# EAGLE schematic Toy (EAGLE 9.5.2)
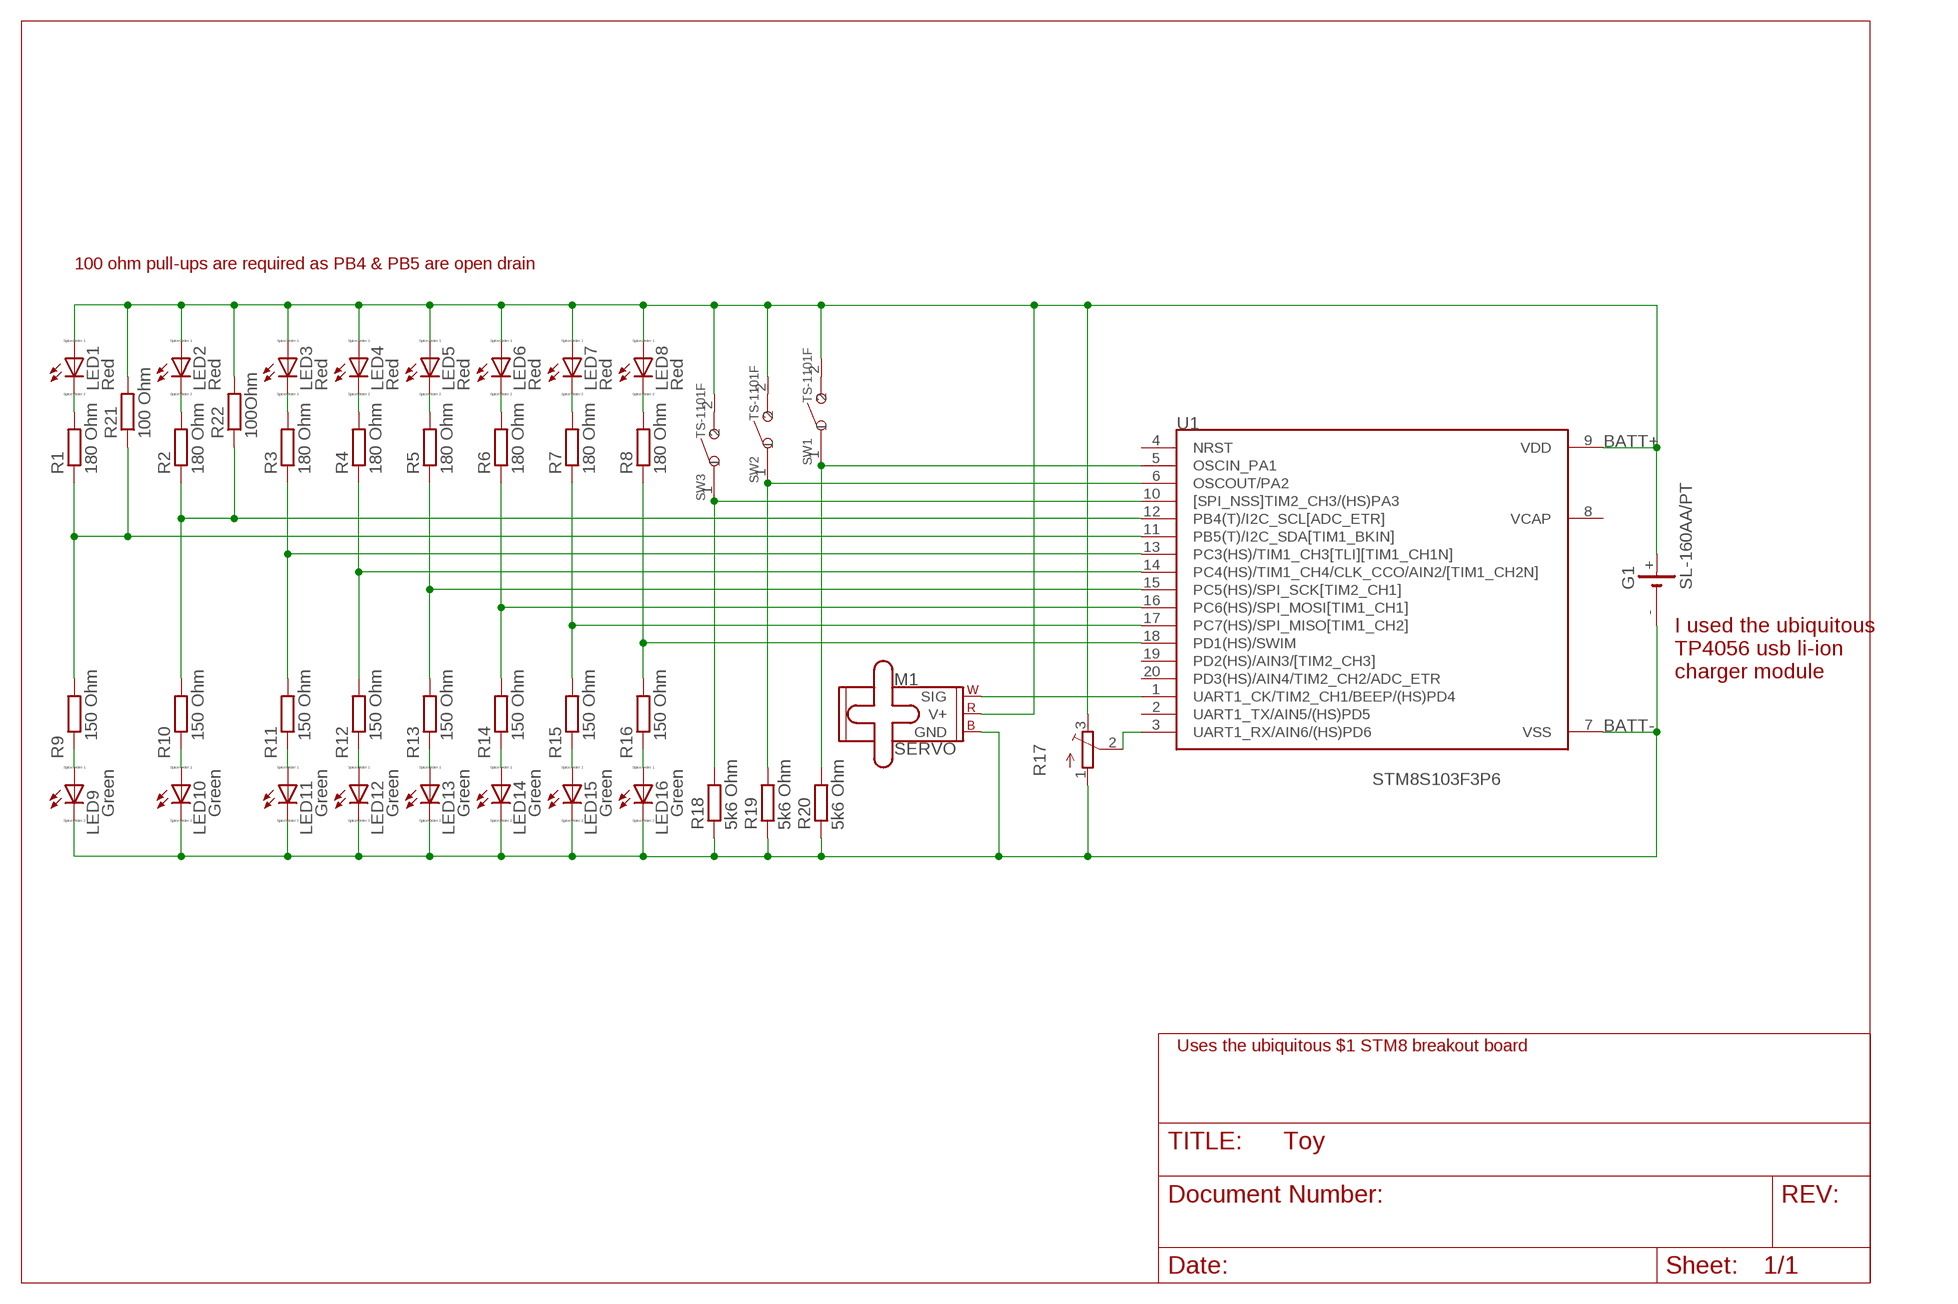
[diagram p0: schematic, sheet 1]

## Parts
G1  SL-160AA/PT  [SL-160AA/PT]
LED1  Red  LED_ELD260  [LED_LD260]
LED2  Red  LED_ELD260  [LED_LD260]
LED3  Red  LED_ELD260  [LED_LD260]
LED4  Red  LED_ELD260  [LED_LD260]
LED5  Red  LED_ELD260  [LED_LD260]
LED6  Red  LED_ELD260  [LED_LD260]
LED7  Red  LED_ELD260  [LED_LD260]
LED8  Red  LED_ELD260  [LED_LD260]
LED9  Green  LED_ELD260  [LED_LD260]
LED10  Green  LED_ELD260  [LED_LD260]
LED11  Green  LED_ELD260  [LED_LD260]
LED12  Green  LED_ELD260  [LED_LD260]
LED13  Green  LED_ELD260  [LED_LD260]
LED14  Green  LED_ELD260  [LED_LD260]
LED15  Green  LED_ELD260  [LED_LD260]
LED16  Green  LED_ELD260  [LED_LD260]
M1  SERVO  [1X03]
R1  180 Ohm  R-EU_0204/7  [0204/7]
R2  180 Ohm  R-EU_0204/7  [0204/7]
R3  180 Ohm  R-EU_0204/7  [0204/7]
R4  180 Ohm  R-EU_0204/7  [0204/7]
R5  180 Ohm  R-EU_0204/7  [0204/7]
R6  180 Ohm  R-EU_0204/7  [0204/7]
R7  180 Ohm  R-EU_0204/7  [0204/7]
R8  180 Ohm  R-EU_0204/7  [0204/7]
R9  150 Ohm  R-EU_0204/7  [0204/7]
R10  150 Ohm  R-EU_0204/7  [0204/7]
R11  150 Ohm  R-EU_0204/7  [0204/7]
R12  150 Ohm  R-EU_0204/7  [0204/7]
R13  150 Ohm  R-EU_0204/7  [0204/7]
R14  150 Ohm  R-EU_0204/7  [0204/7]
R15  150 Ohm  R-EU_0204/7  [0204/7]
R16  150 Ohm  R-EU_0204/7  [0204/7]
R17  TRIM_EU-3223G  [3223G]
R18  5k6 Ohm  R-EU_0204/7  [0204/7]
R19  5k6 Ohm  R-EU_0204/7  [0204/7]
R20  5k6 Ohm  R-EU_0204/7  [0204/7]
R21  100 Ohm  R-EU_0204/7  [0204/7]
R22  100Ohm  R-EU_0204/7  [0204/7]
SW1  TS-1101F  DIP-BUTTON(2P-6.0X3.0X4.3MM)-TS-1101F  [SW2-5.0-6.0X3.0X4.3MM]
SW2  TS-1101F  DIP-BUTTON(2P-6.0X3.0X4.3MM)-TS-1101F  [SW2-5.0-6.0X3.0X4.3MM]
SW3  TS-1101F  DIP-BUTTON(2P-6.0X3.0X4.3MM)-TS-1101F  [SW2-5.0-6.0X3.0X4.3MM]
U1  STM8S103F3P6  [SOP65P640X120-20N]

## Nets
BATT+: G1.+ LED1.A LED2.A LED3.A LED4.A LED5.A LED6.A LED7.A LED8.A M1.2(V+) R17.3(E) R21.2 R22.2 SW1.2 SW2.2 SW3.2 U1.9(VDD)
BATT-: G1.- LED9.K(C) LED10.K(C) LED11.K(C) LED12.K(C) LED13.K(C) LED14.K(C) LED15.K(C) LED16.K(C) M1.3(GND) R17.1(A) R18.1 R19.1 R20.1 U1.7(VSS)
N$1: LED9.A R9.1
N$2: LED10.A R10.1
N$3: LED11.A R11.1
N$4: LED12.A R12.1
N$5: LED13.A R13.1
N$6: LED14.A R14.1
N$7: LED15.A R15.1
N$8: LED16.A R16.1
N$9: LED1.K(C) R1.2
N$10: LED2.K(C) R2.2
N$11: LED3.K(C) R3.2
N$12: LED4.K(C) R4.2
N$13: LED5.K(C) R5.2
N$14: LED6.K(C) R6.2
N$15: LED7.K(C) R7.2
N$16: LED8.K(C) R8.2
N$17: R1.1 R9.2 R21.1 U1.11(PB5(T)/I2C_SDA[TIM1_BKIN])
N$18: R2.1 R10.2 R22.1 U1.12(PB4(T)/I2C_SCL[ADC_ETR])
N$19: R3.1 R11.2 U1.13(PC3(HS)/TIM1_CH3[TLI][TIM1_CH1N])
N$20: R5.1 R13.2 U1.15(PC5(HS)/SPI_SCK[TIM2_CH1])
N$21: R4.1 R12.2 U1.14(PC4(HS)/TIM1_CH4/CLK_CCO/AIN2/[TIM1_CH2N])
N$22: R6.1 R14.2 U1.16(PC6(HS)/SPI_MOSI[TIM1_CH1])
N$23: R7.1 R15.2 U1.17(PC7(HS)/SPI_MISO[TIM1_CH2])
N$24: R8.1 R16.2 U1.18(PD1(HS)/SWIM)
N$25: M1.1(SIG) U1.1(UART1_CK/TIM2_CH1/BEEP/(HS)PD4)
N$26: R20.2 SW1.1 U1.5(OSCIN_PA1)
N$27: R19.2 SW2.1 U1.6(OSCOUT/PA2)
N$28: R18.2 SW3.1 U1.10([SPI_NSS]TIM2_CH3/(HS)PA3)
N$29: R17.2(S) U1.3(UART1_RX/AIN6/(HS)PD6)
Unconnected: G1.-@1(-) U1.2(UART1_TX/AIN5/(HS)PD5) U1.4(NRST) U1.8(VCAP) U1.19(PD2(HS)/AIN3/[TIM2_CH3]) U1.20(PD3(HS)/AIN4/TIM2_CH2/ADC_ETR)

## Notes on the sheet
- 100 ohm pull-ups are required as PB4 & PB5 are open drain
- I used the ubiquitous 
  TP4056 usb li-ion 
  charger module
- Uses the ubiquitous $1 STM8 breakout board

## Library data of the parts
G1 = battery:SL-160AA/PT: LI BATTERY Sonnenschein
LED1-LED16 = eagle-ltspice:LED_E: LED Source: http://www.osram.convergy.de Source: www.luxeon.com Source: www.kingbright.com; SPICEMODEL: NONE; SPICEPREFIX: D; SPICETYPE: diode
M1 = SparkFun-Electromechanical:SERVO: Servo Motor 3-pin connector for a standard servo motor (voltage supply, ground, and control signal.) SparkFun Products Servo - Generic (Sub-Micro Size) <https://www.sparkfun.com/products/9065> (ROB-09065) Servo - Generic High Torque Continuous Rotation (Standard Size) <https://www.sparkfun.com/products/9347> (ROB-09347) Servo - Generic High Torque (Standard Size) <https://www.sparkfun.com/products/11965> (ROB-11965)
R1-R16 R18-R20 = rcl:R-EU_: RESISTOR, European symbol; SPICEPREFIX: R
R17 = pot:TRIM_EU-: POTENTIOMETER
R21 R22 = resistor:R-EU_: RESISTOR, European symbol
SW1-SW3 = Seeed-Switch:DIP-BUTTON(2P-6.0X3.0X4.3MM): 311020025; MPN: TS-1101F
U1 = STM8S103F3P6:STM8S103F3P6: Mainstream Access line 8-bit MCU with 8 Kbytes Flash, 16 MHz CPU, integrated EEPROM; AVAILABILITY: Unavailable; DESCRIPTION: STM8 STM8S Microcontroller IC 8-Bit 16MHz 8KB _8K x 8_ FLASH 20-TSSOP; MF: STMicroelectronics; MP: STM8S103F3P6; PACKAGE: TSSOP-20 STMicroelectronics; PRICE: None